# EAGLE design untitled (EAGLE 5.06)
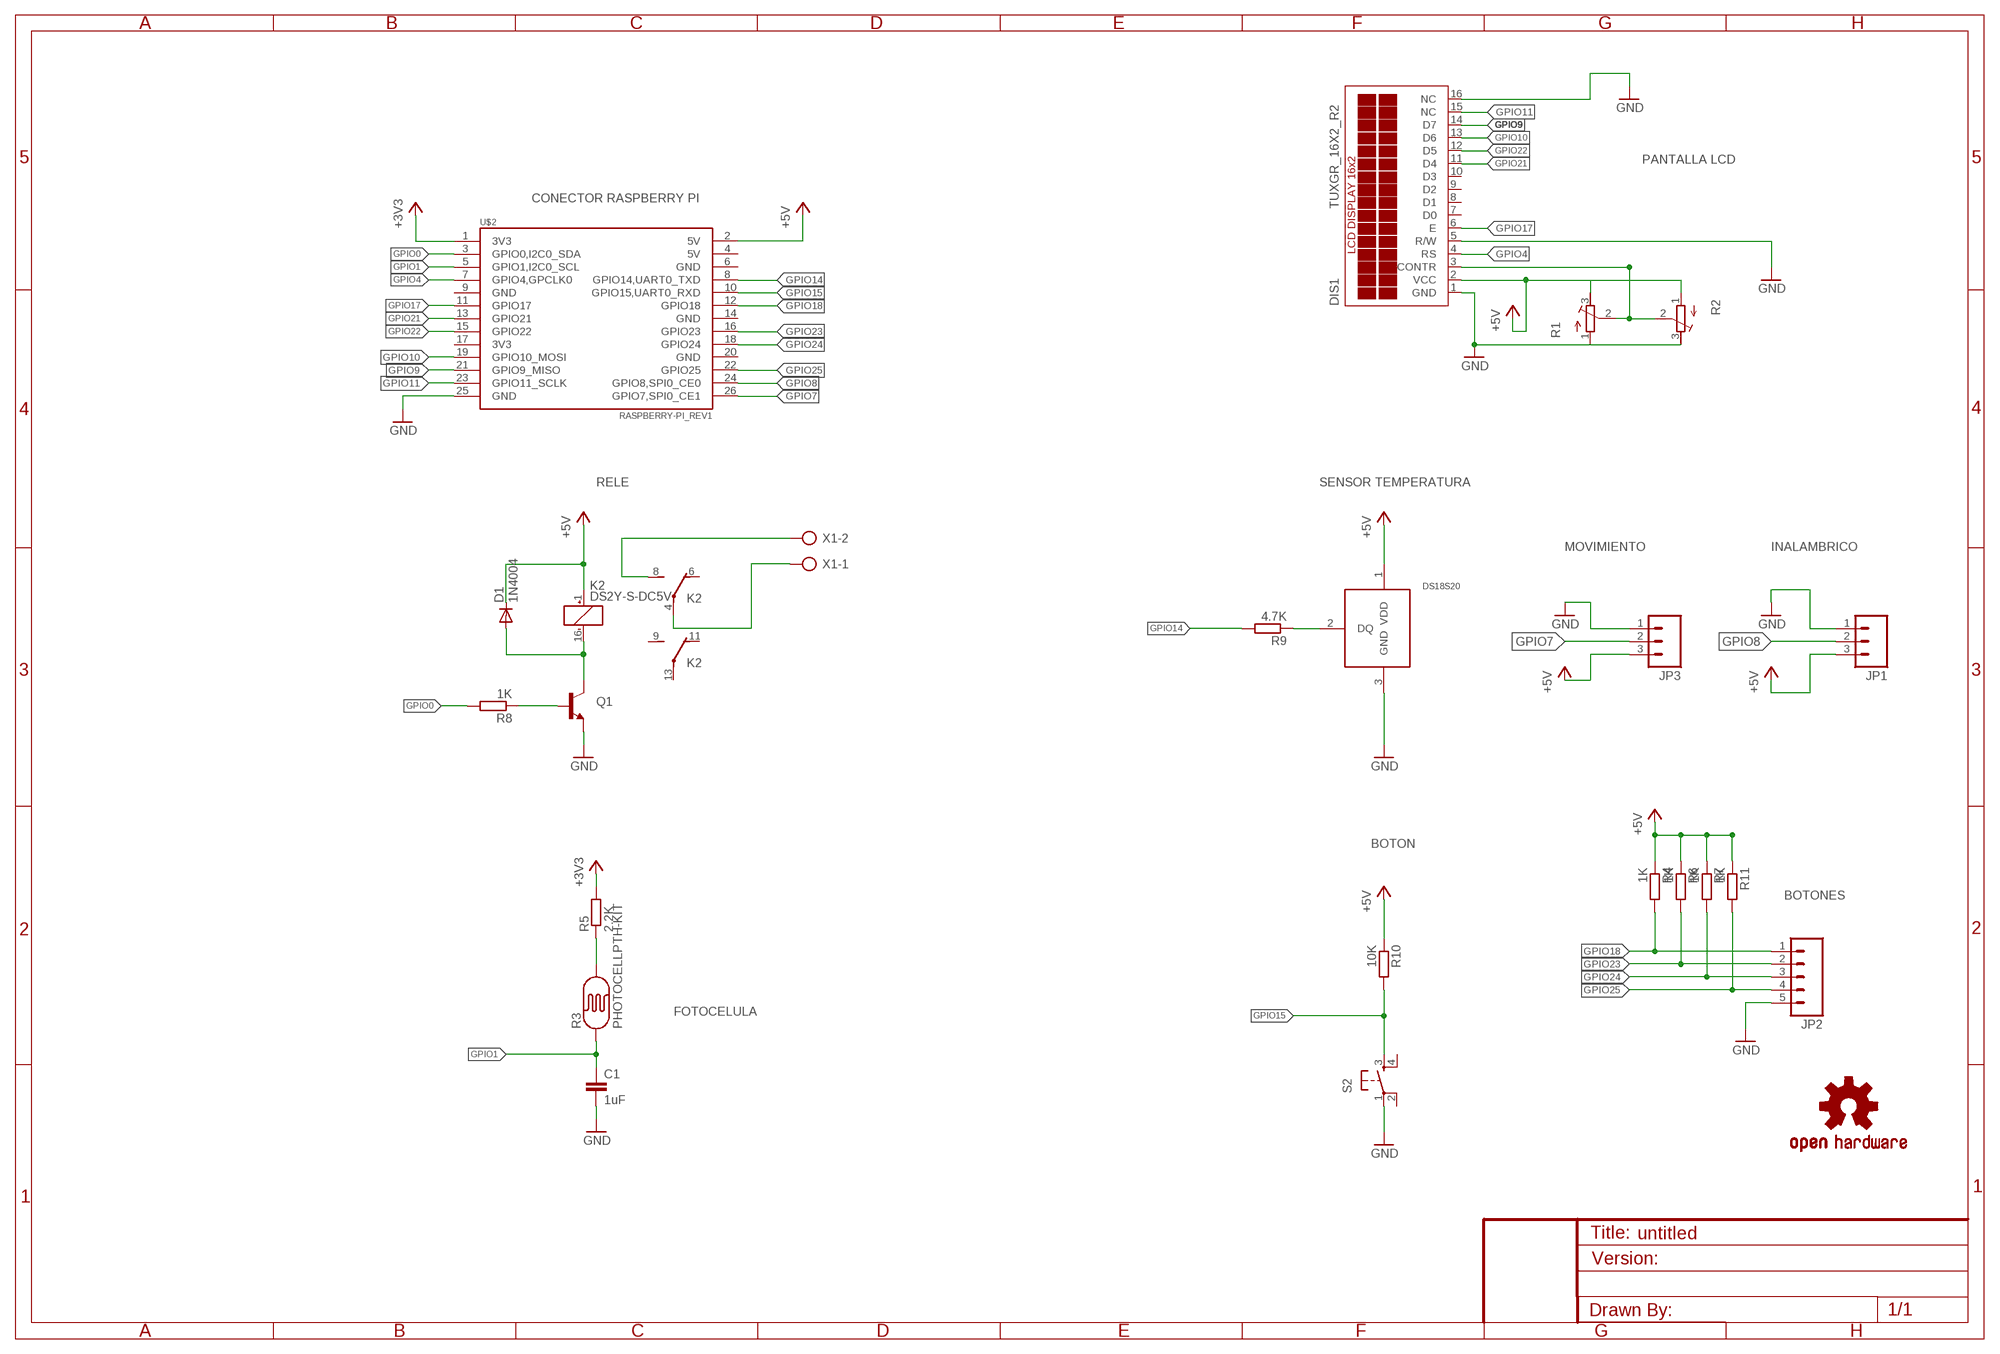
[diagram p0: schematic, sheet 1]

## Parts
C1  1uF  C5/3.5  [C5B3.5]
D1  1N4004  [DO41-10]
DIS1  TUXGR_16X2_R2  [TUXGR_16X2_R2]
DS18S20  18S20  [TO-92]
JP1  M03POLAR  [MOLEX-1X3]
JP2  M05PTH  [1X05]
JP3  M03POLAR  [MOLEX-1X3]
K2  DS2Y-S-DC5V  [DS2Y]
Q1  TRANSISTOR_NPNTO-92-AMMO  [TO-92-AMMO]
R1  R-TRIMM64W  [RTRIM64W]
R2  R-TRIMM64Y  [RTRIM64Y]
R3  PHOTOCELLPTH-KIT  [PHOTOCELL-KIT]
R4  1K  R-EU_0207/10  [0207/10]
R5  2.2K  R-EU_0207/10  [0207/10]
R6  1K  R-EU_0207/10  [0207/10]
R7  1K  R-EU_0207/10  [0207/10]
R8  1K  R-EU_0207/10  [0207/10]
R9  4.7K  R-EU_0207/10  [0207/10]
R10  10K  R-EU_0207/10  [0207/10]
R11  1K  R-EU_0207/10  [0207/10]
S2  TAC_SWITCHPTH  [TACTILE-PTH]
U$1  OSHW-LOGOL  [OSHW-LOGO-L]
U$2  RASPBERRY-PI_REV1  [RASPBERRY-PI_REV1]
X1  AK500/2  [AK500/2]

## Nets
+3V3: R5.2 U$2.1(3V3)
+5V: D1.C DIS1.2(VCC) DS18S20.1(VDD) JP1.3 JP3.3 K2.1(1:+) R1.3(A) R2.1(E) R4.1 R6.1 R7.1 R10.1 R11.1 U$2.2(5V)
GND: C1.2 DIS1.1(GND) DIS1.5(R/W) DIS1.16(NC) DS18S20.3(GND) JP1.1 JP2.5 JP3.1 Q1.1(E) R1.1(E) R2.3(A) S2.1 U$2.25(GND)
GPIO0: R8.2 U$2.3(GPIO0,I2C0_SDA)
GPIO1: C1.1 R3.1 U$2.5(GPIO1,I2C0_SCL)
GPIO4: DIS1.4(RS) U$2.7(GPIO4,GPCLK0)
GPIO7: JP3.2 U$2.26(GPIO7,SPI0_CE1)
GPIO8: JP1.2 U$2.24(GPIO8,SPI0_CE0)
GPIO9: DIS1.14(D7) U$2.21(GPIO9_MISO)
GPIO10: DIS1.13(D6) U$2.19(GPIO10_MOSI)
GPIO11: DIS1.15(NC) U$2.23(GPIO11_SCLK)
GPIO14: R9.2 U$2.8(GPIO14,UART0_TXD)
GPIO15: R10.2 S2.3 U$2.10(GPIO15,UART0_RXD)
GPIO17: DIS1.6(E) U$2.11(GPIO17)
GPIO18: JP2.1 R4.2 U$2.12(GPIO18)
GPIO21: DIS1.11(D4) U$2.13(GPIO21)
GPIO22: DIS1.12(D5) U$2.15(GPIO22)
GPIO23: JP2.2 R6.2 U$2.16(GPIO23)
GPIO24: JP2.3 R7.2 U$2.18(GPIO24)
GPIO25: JP2.4 R11.2 U$2.22(GPIO25)
N$1: D1.A K2.16(1:-) Q1.3(C)
N$3: R3.2 R5.1
N$4: Q1.2(B) R8.1
N$5: DS18S20.2(DQ) R9.1
N$6: K2.8(2:S) X1.2
N$8: DIS1.3(CONTR) R1.2(S) R2.2(S)
N$9: K2.4(2:P) X1.1
Unconnected: DIS1.7(D0) DIS1.8(D1) DIS1.9(D2) DIS1.10(D3) K2.6(2:O) K2.9(3:S) K2.11(3:O) K2.13(3:P) S2.2 S2.4 U$2.4(5V) U$2.6(GND) U$2.9(GND) U$2.14(GND) U$2.17(3V3) U$2.20(GND)

## Notes on the sheet
- PANTALLA LCD
- CONECTOR RASPBERRY PI
- RELE | SENSOR TEMPERATURA
- MOVIMIENTO | INALAMBRICO
- BOTON
- BOTONES
- FOTOCELULA

## Library data of the parts
C1 = capacitor-wima:C: CAPACITOR naming: grid - package width
D1 = diode:1N4004: DIODE general purpose rectifier, 1 A
DIS1 = display-lcd:TUXGR_16X2_R2: Tuxgraphics LCD display 16x2 characters reflective, without background light Source: tuxgr_12x2_r2.pdf
DS18S20 = merriman:18S20: Dallas/Maxim 18S20 1-Wire temperature sensor (including PAR, since assumes pin 3 NOT connected internally on that variant)
JP1 JP3 = SparkFun:M03: Header 3 Standard 3-pin 0.1" header. Use with straight break away headers (SKU : PRT-00116), right angle break away headers (PRT-00553), swiss pins (PRT-00743), machine pins (PRT-00117), and female headers (PRT-00115). Molex polarized connector foot print use with SKU : PRT-08232 with associated crimp pins and housings.
JP2 = SparkFun:M05: Header 5 Standard 5-pin 0.1" header. Use with straight break away headers (SKU : PRT-00116), right angle break away headers (PRT-00553), swiss pins (PRT-00743), machine pins (PRT-00117), and female headers (PRT-00115). Molex polarized connector foot print use with SKU : PRT-08230 with associated crimp pins and housings.
K2 = relay:DS2Y-S-DC*: MINIATURE RELAY NAiS Source: http://www.mew-europe.com/.. en_ds_61005_0023.pdf
Q1 = SparkFun:TRANSISTOR_NPN: Transistor NPN BJT configuration in SOT23 package. MMBT2222 is the common NPN we use. Double check BCE configuration again layout.
R1 R2 = resistor:R-TRIMM: Trimm resistor
R3 = SparkFun:PHOTOCELL: Photocell Also known as a CdS photoresistor. This is a low cost way to detect light levels. Resistance decreases with more incoming light. SparkFun SKU: SEN-09088
R4-R11 = rcl:R-EU_: RESISTOR, European symbol
S2 = SparkFun:TAC_SWITCH: Momentary Switch Button commonly used for reset or general input. Spark Fun Electronics SKU : COM-00097
U$1 = SparkFun:OSHW-LOGO: Open Source Hardware Logo This logo indicates the piece of hardware it is found on incorporates a OSHW license and/or adheres to the definition of open source hardware found here: http://freedomdefined.org/OSHW
U$2 = RaspberryPi:RASPBERRY-PI_REV1: Raspberry Pi Board <http://www.raspberrypi.org/> Jacques Lagnel V1.0 (beta) 2012 Mateusz Bawaj V1.1 (beta) 2012 Board dimension: Forum 3D model <http://www.raspberrypi.org/forum/general-discussion/mechanical-profile-3d-models?value=3d%20model&type=1&include=1&search=1&ret=all> The GPIO Connector (P1): http://elinux.org/RPi_Low-level_peripherals
X1 = con-ptr500:AK500/2: CONNECTOR

## Board
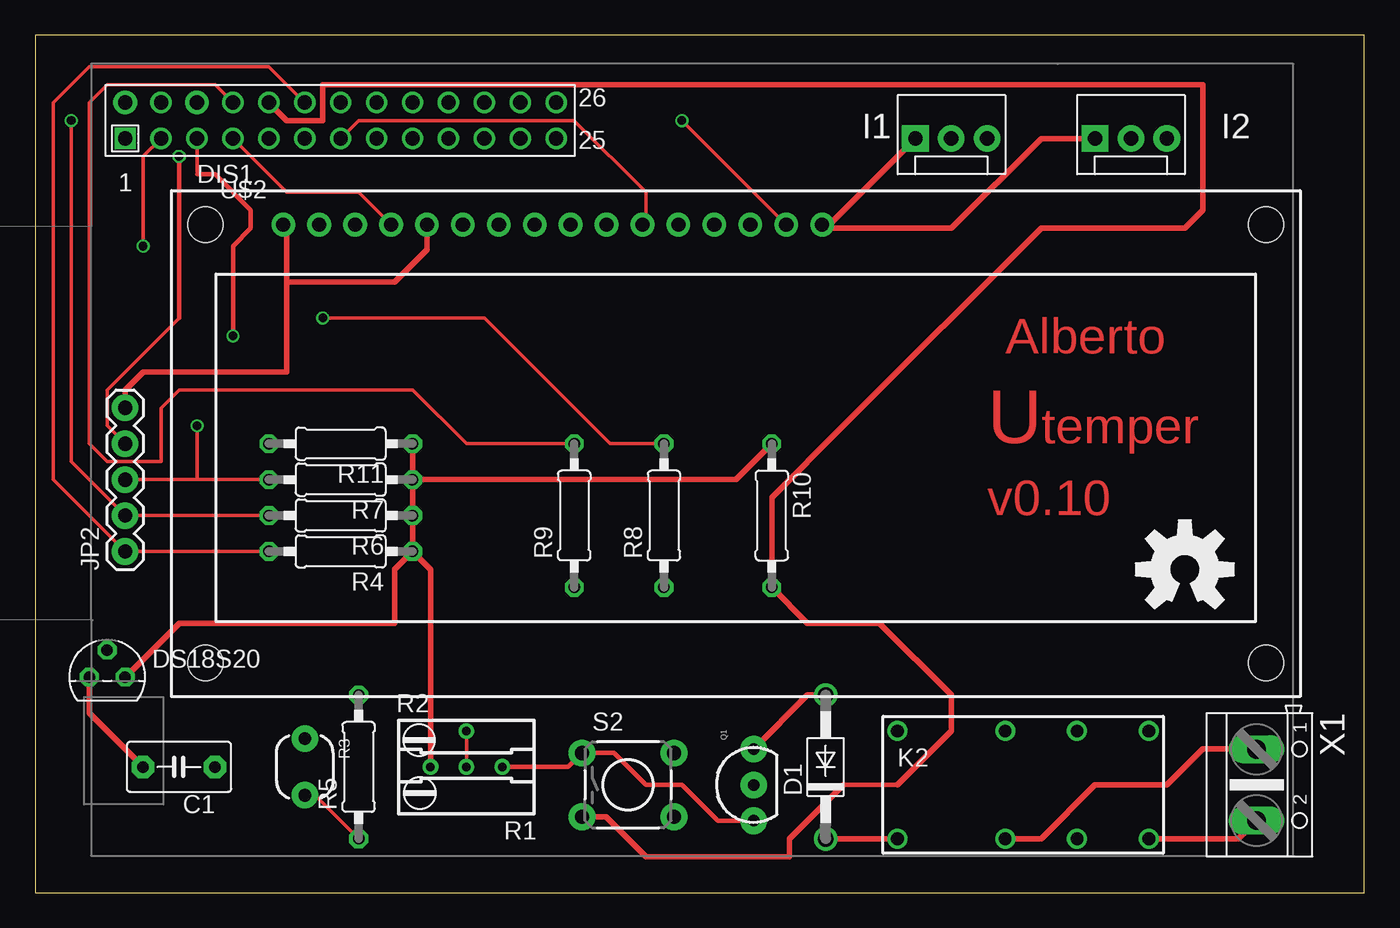
[diagram p1: board, top side]
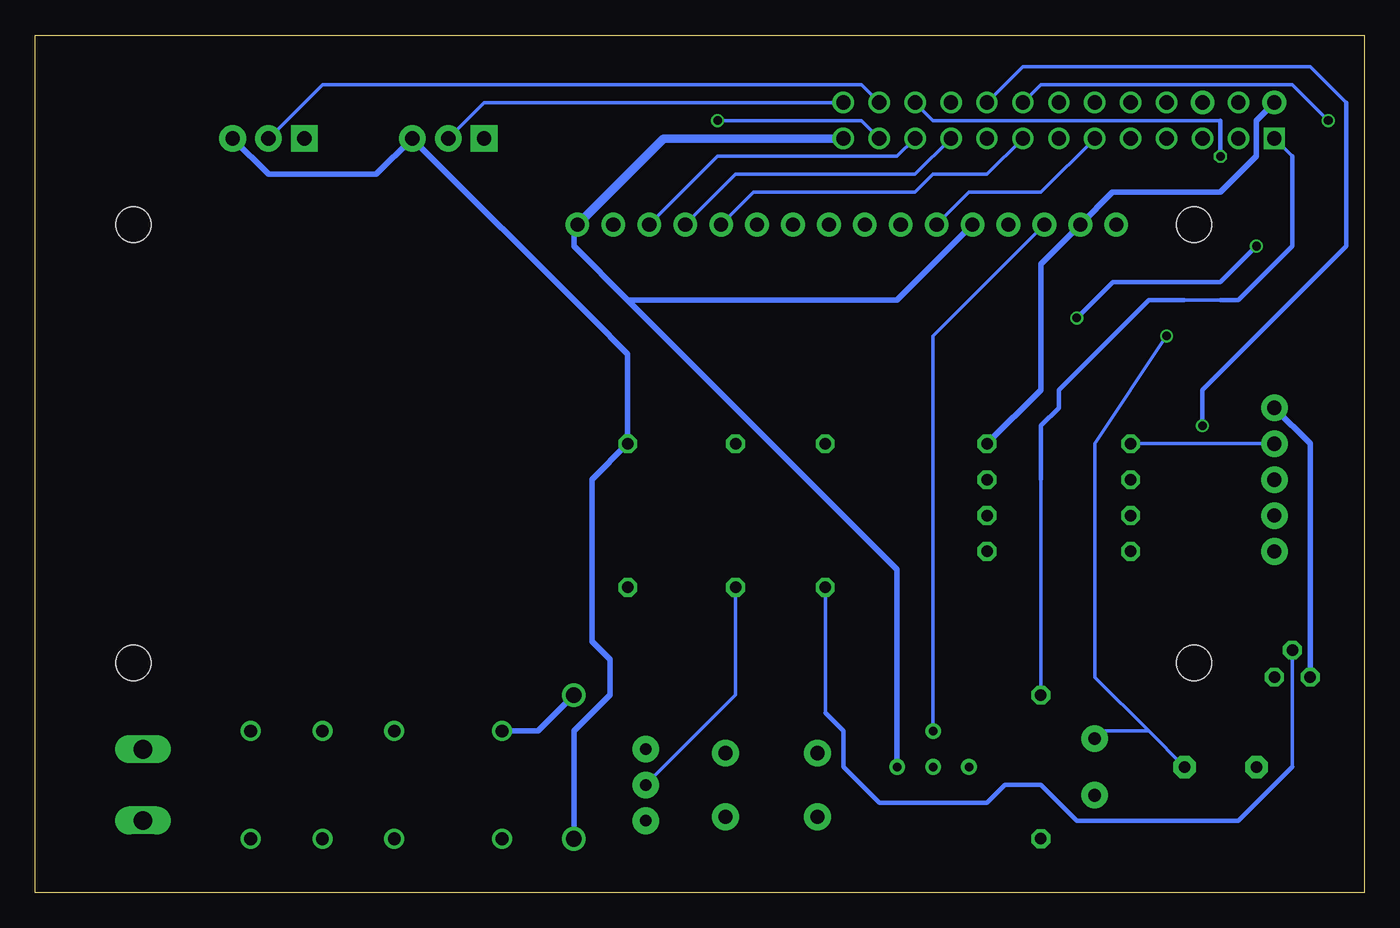
[diagram p2: board, bottom side, seen from below]

Size 93.96 x 60.63 mm. Coordinates in mm from the lower left corner, seen from the top.
Outline: 0,0 93.96,0 93.96,60.63 0,60.63 0,0
Copper layers (1*16): Top 0.035mm / dielectric 1.5mm / Bottom 0.035mm
Design rules "SeeedStudio_DRU_no_angle_2layer": minimum track width 6mil, minimum drill 12mil, track to track 6mil, track to pad 6mil, pad to pad 6mil, via to via 6mil, smd to smd 0mil, copper to edge 10mil, drill to drill 10mil, minimum pad ring 10mil, minimum via ring 6mil, stop-mask expansion 2mil, vias tented up to drill 25mil, thermal gap 10mil

### Footprints (pad centres in the part's own frame; a part is rotated, then mirrored left to right if it is on the bottom)
C5B3.5 = drill 0.813 pad 1.6 octagon: 1 -2.54,0; 2 2.54,0
DO41-10 = drill 1.118 round: A 5.08,0; C -5.08,0
TUXGR_16X2_R2 = drill 1 pad 1.676 round: 1 -32,15.5; 2 -29.46,15.5; 3 -26.92,15.5; 4 -24.38,15.5; 5 -21.84,15.5; 6 -19.3,15.5; 7 -16.76,15.5; 8 -14.22,15.5; 9 -11.68,15.5; 10 -9.14,15.5; 11 -6.6,15.5; 12 -4.06,15.5; 13 -1.52,15.5; 14 1.02,15.5; 15 3.56,15.5; 16 6.1,15.5 | hole 2.5: -37.5,-15.5; 37.5,-15.5; -37.5,15.5; 37.5,15.5
TO-92 = drill 0.813 octagon: 1 1.27,0; 2 0,1.905; 3 -1.27,0
MOLEX-1X3 = drill 1.016 pad 1.88 square: 1 0,0 | drill 1.016 pad 1.88 round: 2 2.54,0; 3 5.08,0
1X05 = drill 1.016 pad 1.88 round: 1 0,0; 2 2.54,0; 3 5.08,0; 4 7.62,0; 5 10.16,0
DS2Y = drill 0.9 round: 1 -8.89,-3.81; 4 -1.27,-3.81; 6 3.81,-3.81; 8 8.89,-3.81; 9 8.89,3.81; 11 3.81,3.81; 13 -1.27,3.81; 16 -8.89,3.81
TO-92-AMMO = drill 0.813 pad 1.88 round: 1 -2.54,0; 2 0,0; 3 2.54,0
RTRIM64W = drill 0.61 round: 1 1.27,-2.54; 2 1.27,0; 3 1.27,2.54
RTRIM64Y = drill 0.61 round: 1 0,-2.54; 2 -2.54,0; 3 0,2.54
PHOTOCELL-KIT = drill 0.9 pad 1.88 round: 1 -2,0; 2 2,0
0207/10 = drill 0.813 octagon: 1 -5.08,0; 2 5.08,0
TACTILE-PTH = drill 1.016 pad 1.88 round: 1 -3.251,2.261; 2 3.251,2.261; 3 -3.251,-2.261; 4 3.251,-2.261
RASPBERRY-PI_REV1 = drill 1 square: 1 -41.91,21.59 | drill 1 pad 1.676 round: 2 -41.91,24.13; 6 -36.83,24.13 | drill 1 round: 3 -39.37,21.59; 4 -39.37,24.13; 5 -36.83,21.59; 7 -34.29,21.59; 8 -34.29,24.13; 9 -31.75,21.59; 10 -31.75,24.13; 11 -29.21,21.59; 12 -29.21,24.13; 13 -26.67,21.59; 14 -26.67,24.13; 15 -24.13,21.59; 16 -24.13,24.13; 17 -21.59,21.59; 18 -21.59,24.13; 19 -19.05,21.59; 20 -19.05,24.13; 21 -16.51,21.59; 22 -16.51,24.13; 23 -13.97,21.59; 24 -13.97,24.13; 25 -11.43,21.59; 26 -11.43,24.13
AK500/2 = drill 1.321 long: 1 -2.515,0; 2 2.515,0

### Placement (x,y rotation side)
C1  10.16,8.89 180 top
D1  55.88,8.89 90 top
DIS1  49.53,31.75 0 top
DS18S20  5.08,15.24 0 top
JP1  74.93,53.34 0 top
JP2  6.35,24.13 90 top
JP3  62.23,53.34 0 top
K2  69.85,7.62 0 top
Q1  50.8,7.62 90 top
R1  30.48,7.62 90 top
R2  30.48,8.89 270 top
R3  19.05,8.89 270 top
R4  21.59,24.13 180 top
R5  22.86,8.89 90 top
R6  21.59,26.67 180 top
R7  21.59,29.21 180 top
R8  44.45,26.67 90 top
R9  38.1,26.67 90 top
R10  52.07,26.67 270 top
R11  21.59,31.75 180 top
S2  41.91,7.62 0 top
U$1  81.28,22.86 0 top
U$2  48.26,31.75 0 top
X1  86.36,7.62 270 top

### Tracks (layer width: path | path; a pad name or v marks a point on that pad's centre or on a via)
+3V3
  Bottom 0.254: R5.2 22.86,29.21 | 5.08,52.07 U$2.1 | 12.7,41.91 10.16,41.91
  Bottom 0.305: 22.86,29.21 22.86,33.02 21.59,34.29 21.59,35.56 17.78,39.37 15.24,41.91 12.7,41.91 | 5.08,52.07 5.08,45.72 8.89,41.91 10.16,41.91
+5V
  Top 0.406: D1.C K2.1 | R7.1 R11.1 | R7.1 49.53,29.21 R10.1 | R7.1 R6.1 R4.1 | R4.1 27.94,22.86 R2.1 | R4.1 25.4,22.86 25.4,19.05 17.78,19.05 10.16,19.05 DS18S20.1
  Bottom 0.254: JP3.3 66.04,52.07 | 20.32,46.99 DIS1.2
  Bottom 0.406: D1.C 55.88,8.89 55.88,11.43 53.34,13.97 53.34,16.51 54.61,17.78 54.61,29.21 R10.1 52.07,38.1 54.61,40.64 JP3.3 69.85,50.8 77.47,50.8 JP1.3 | R11.1 22.86,35.56 22.86,44.45 20.32,46.99 DIS1.2 17.79,49.53 17.78,49.53 10.16,49.53 7.62,52.07 7.62,54.61 U$2.2
GND
  Top 0.254: DIS1.16 55.88,46.99
  Top 0.305: R2.3 37.67,8.89 S2.1 40.92,9.88 43.18,7.62 45.72,7.62 48.26,5.08 Q1.1
  Top 0.406: JP1.1 72.39,53.34 71.12,53.34 64.77,46.99 55.89,46.99 DIS1.16 56.14,47.25 JP3.1 | JP2.5 6.35,35.56 7.62,36.83 17.78,36.83 17.78,43.18 | 17.78,43.18 17.78,47 DIS1.1 | DIS1.5 27.69,45.47 25.4,43.18 17.78,43.18 | DS18S20.3 3.81,12.7 C1.2
  Bottom 0.254: 55.88,46.99 DIS1.16 | DIS1.5 27.94,46.99
  Bottom 0.406: 55.88,46.99 55.88,45.72 52.07,41.91 | 52.07,41.91 33.02,22.86 R2.3 | 27.94,46.99 33.02,41.91 52.07,41.91 | JP2.5 3.81,31.75 DS18S20.3
  Bottom 0.61: U$2.25 49.53,53.34 49.54,53.34 DIS1.16
GPIO0  (via drill 0.61)
  Top 0.254: R8.2 40.64,31.75 31.75,40.64 v20.32,40.64 | v7.62,45.72 7.62,52.07 U$2.3
  Bottom 0.305: v20.32,40.64 17.78,43.18 16.51,43.18 11.43,43.18 10.16,43.18 v7.62,45.72
GPIO1  (via drill 0.61)
  Top 0.254: 11.43,50.8 U$2.5
  Top 0.305: 11.43,50.8 12.7,50.8 15.24,48.26 15.24,46.99 13.97,45.72 v13.97,39.37
  Bottom 0.254: v13.97,39.37 19.05,31.75 19.05,15.24 15.24,11.43 | C1.1 15.24,11.43 | 15.24,11.43 19.05,11.43 R3.1
GPIO4
  Top 0.254: U$2.7 17.78,49.53 22.86,49.53 25.4,46.99 DIS1.4
GPIO7
  Bottom 0.254: U$2.26 62.23,55.88 JP3.2
GPIO8
  Bottom 0.254: U$2.24 35.56,57.15 73.66,57.15 JP1.2
GPIO9
  Bottom 0.254: U$2.21 33.02,52.07 45.72,52.07 50.8,46.99 DIS1.14
GPIO10
  Bottom 0.254: U$2.19 31.75,50.8 44.45,50.8 48.26,46.99 DIS1.13
GPIO11  (via drill 0.61)
  Top 0.254: v45.72,54.61 53.34,46.99 DIS1.15
  Bottom 0.254: U$2.23 35.56,54.61 v45.72,54.61
GPIO14
  Top 0.254: R9.2 30.48,31.75 26.67,35.56 10.16,35.56 8.89,34.29 8.89,30.48 5.08,30.48 3.81,31.75 3.81,55.88 5.08,57.15 12.7,57.15 U$2.8
GPIO15
  Top 0.305: 57.15,7.62 60.96,7.62
  Top 0.406: S2.3 40.36,5.36 40.64,5.08 43.18,2.54 53.34,2.54 53.34,3.81 57.15,7.62 | 60.96,7.62 64.77,11.43 64.77,13.97 59.69,19.05 54.61,19.05 R10.2 52.07,27.94 57.15,33.02 71.12,46.99 81.28,46.99 82.55,48.26 82.55,57.15 20.32,57.15 20.32,54.61 17.78,54.61 U$2.10
GPIO17
  Bottom 0.254: U$2.11 22.86,49.53 27.94,49.53 30.48,46.99 DIS1.6
GPIO18
  Top 0.254: R4.2 JP2.1 1.27,29.21 1.27,55.88 3.81,58.42 16.51,58.42 U$2.12
GPIO21
  Top 0.254: U$2.13 22.86,54.61 38.1,54.61 43.18,49.53 43.18,46.99 DIS1.11
GPIO22
  Bottom 0.254: U$2.15 26.67,50.8 30.48,50.8 31.75,49.53 43.18,49.53 45.72,46.99 DIS1.12
GPIO23  (via drill 0.61)
  Top 0.254: R6.2 JP2.2 2.54,30.48 v2.54,54.61
  Bottom 0.254: U$2.16 22.86,57.15 5.08,57.15 v2.54,54.61
GPIO24  (via drill 0.61)
  Top 0.254: JP2.3 11.43,29.21 | 11.43,29.21 R7.2 | 11.43,29.21 v11.43,33.02
  Bottom 0.254: U$2.18 24.13,58.42 3.81,58.42 1.27,55.88
  Bottom 0.305: v11.43,33.02 11.43,35.56 8.89,38.1 1.27,45.72 1.27,55.88
GPIO25  (via drill 0.6)
  Top 0.254: 10.16,40.64 5.08,35.56 5.08,33.02 JP2.4
  Top 0.305: 10.16,40.64 v10.16,52.07
  Bottom 0.254: JP2.4 R11.2 | U$2.22 30.48,54.61 10.16,54.61
  Bottom 0.305: v10.16,52.07 10.16,54.61
N$1
  Top 0.406: D1.A 54.61,13.97 Q1.3
  Bottom 0.406: K2.16 58.42,11.43 D1.A
N$3
  Top 0.254: R5.1 19.05,7.62 R3.2
N$4
  Bottom 0.254: R8.1 44.45,13.97 Q1.2
N$5
  Bottom 0.254: 5.08,8.89 5.08,16.51 DS18S20.2 | 38.1,12.7 R9.1
  Bottom 0.305: 5.08,8.89 7.62,6.35 8.89,5.08 20.32,5.08 22.86,7.62 25.4,7.62 26.67,6.35 34.29,6.35 36.83,8.89 36.83,11.43 38.1,12.7
N$6
  Top 0.254: X1.2 86.36,5.08
  Top 0.406: K2.8 85.06,3.81 X1.2
N$8
  Top 0.254: R1.2 R2.2
  Bottom 0.254: R2.2 30.48,39.37 22.86,46.99 DIS1.3
N$9
  Top 0.254: 86.36,10.16 X1.1
  Top 0.406: 86.36,10.16 82.55,10.16 81.28,8.89 80.01,7.62 74.93,7.62 71.12,3.81 K2.4

### Text on the board
Top: Alberto | U | temper | v0.10
tNames: I1 | I2